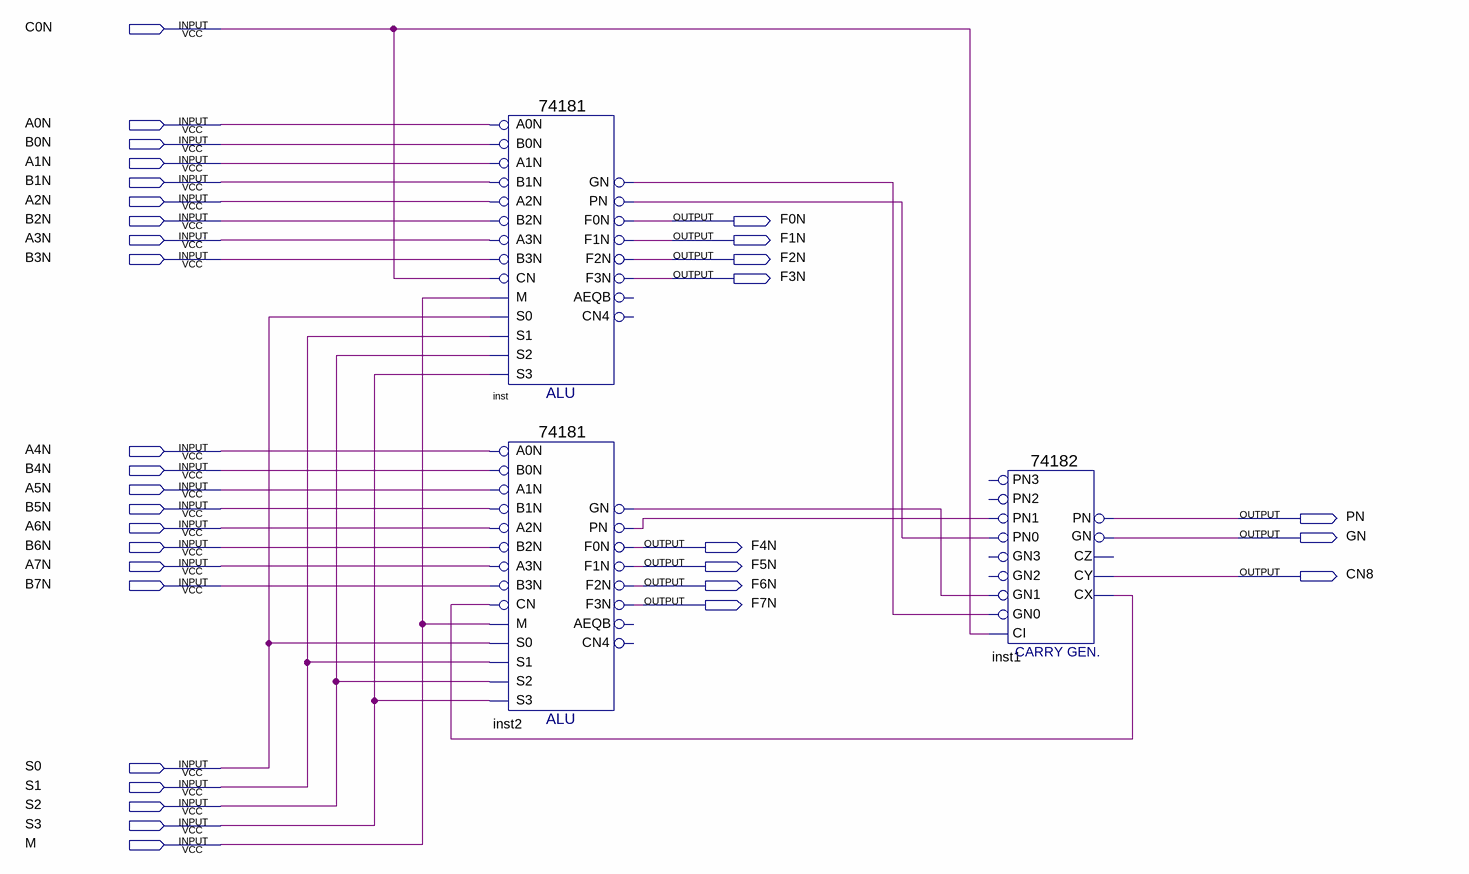
[diagram p0: schematic sheet]
// Quartus schematic ALU-8.bdf as structural Verilog: 3 symbols, 33 pins
module \ALU-8  (
  input  C0N,
  input  A0N,
  input  B0N,
  input  A1N,
  input  B1N,
  input  A2N,
  input  B2N,
  input  A3N,
  input  B3N,
  input  A4N,
  input  B4N,
  input  A5N,
  input  B5N,
  input  A6N,
  input  B6N,
  input  A7N,
  input  B7N,
  input  S0,
  input  S1,
  input  S2,
  input  S3,
  input  M,
  output F0N,
  output F1N,
  output F2N,
  output F3N,
  output PN,
  output GN,
  output F4N,
  output F5N,
  output CN8,
  output F6N,
  output F7N
);

  wire inst1_cx, inst2_gn, inst2_pn, inst_gn, inst_pn;

  \74181  inst (
    .B0N(B0N), .A0N(A0N), .A1N(A1N), .B1N(B1N), .A3N(A3N), .B2N(B2N), .A2N(A2N), .M(M), .CN(C0N), .B3N(B3N),
    .S2(S2), .S1(S1), .S0(S0), .S3(S3), .PN(inst_pn), .GN(inst_gn), .F3N(F3N), .F1N(F1N), .F0N(F0N), .F2N(F2N));  // open: AEQB, CN4
  \74181  inst2 (
    .B0N(B4N), .A0N(A4N), .A1N(A5N), .B1N(B5N), .A3N(A7N), .B2N(B6N), .A2N(A6N), .M(M), .CN(inst1_cx),
    .B3N(B7N), .S2(S2), .S1(S1), .S0(S0), .S3(S3), .PN(inst2_pn), .GN(inst2_gn), .F3N(F7N), .F1N(F5N),
    .F0N(F4N), .F2N(F6N));  // open: AEQB, CN4
  \74182  inst1 (
    .CI(C0N), .PN1(inst2_pn), .PN0(inst_pn), .GN1(inst2_gn), .GN0(inst_gn), .CY(CN8), .PN(PN), .CX(inst1_cx),
    .GN(GN));  // open: PN2, GN2, GN3, PN3, CZ
endmodule
